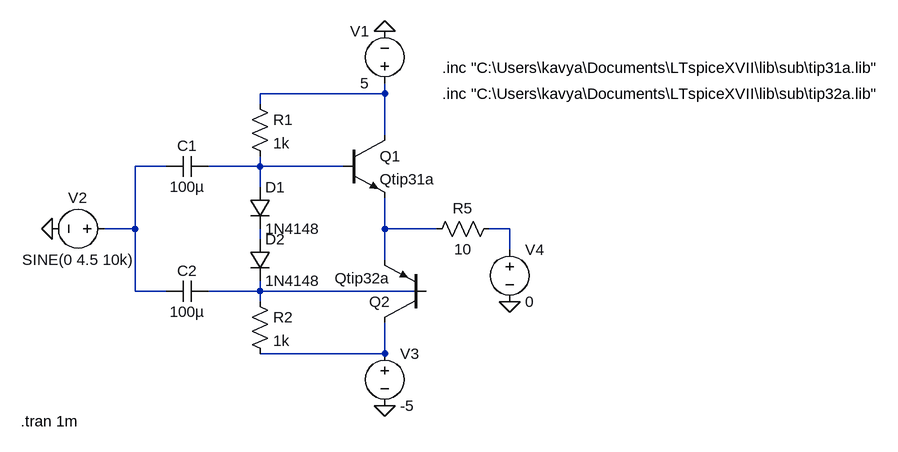
[diagram p0: schematic poweramp.asc]
poweramp.asc, the LTspice schematic file:
Version 4
SHEET 1 1084 680
WIRE 224 -16 224 -32
WIRE 224 -16 32 -16
WIRE 32 0 32 -16
WIRE 224 48 224 -16
WIRE -112 96 -160 96
WIRE 32 96 32 80
WIRE 32 96 -48 96
WIRE 160 96 32 96
WIRE 32 128 32 96
WIRE -160 192 -160 96
WIRE -160 192 -208 192
WIRE 224 192 224 144
WIRE 304 192 224 192
WIRE 416 192 384 192
WIRE 32 208 32 192
WIRE 416 224 416 192
WIRE 224 240 224 192
WIRE -160 288 -160 192
WIRE -112 288 -160 288
WIRE 32 288 32 272
WIRE 32 288 -48 288
WIRE 288 288 32 288
WIRE 32 304 32 288
WIRE 224 384 224 336
WIRE 224 384 32 384
FLAG -288 192 0
FLAG 224 -112 0
FLAG 224 464 0
FLAG 416 304 0
SYMBOL npn 160 48 R0
SYMATTR InstName Q1
SYMATTR Value Qtip31a
SYMBOL res 16 -16 R0
SYMATTR InstName R1
SYMATTR Value 1k
SYMBOL res 16 288 R0
SYMATTR InstName R2
SYMATTR Value 1k
SYMBOL cap -48 80 R90
WINDOW 0 0 32 VBottom 2
WINDOW 3 32 32 VTop 2
SYMATTR InstName C1
SYMATTR Value 100µ
SYMBOL cap -48 272 R90
WINDOW 0 0 32 VBottom 2
WINDOW 3 32 32 VTop 2
SYMATTR InstName C2
SYMATTR Value 100µ
SYMBOL voltage 224 -16 R180
WINDOW 0 24 96 Left 2
WINDOW 3 24 16 Left 2
WINDOW 123 0 0 Left 0
WINDOW 39 0 0 Left 0
SYMATTR InstName V1
SYMATTR Value 5
SYMBOL voltage -192 192 R90
WINDOW 0 -32 56 VBottom 2
WINDOW 3 32 56 VTop 2
WINDOW 123 0 0 Left 0
WINDOW 39 0 0 Left 0
SYMATTR InstName V2
SYMATTR Value SINE(0 4.5 10k)
SYMBOL res 400 176 R90
WINDOW 0 0 56 VBottom 2
WINDOW 3 32 56 VTop 2
SYMATTR InstName R5
SYMATTR Value 10
SYMBOL voltage 224 368 R0
WINDOW 123 0 0 Left 0
WINDOW 39 0 0 Left 0
SYMATTR InstName V3
SYMATTR Value -5
SYMBOL voltage 416 208 R0
WINDOW 123 0 0 Left 0
WINDOW 39 0 0 Left 0
SYMATTR InstName V4
SYMATTR Value 0
SYMBOL diode 16 128 R0
SYMATTR InstName D1
SYMATTR Value 1N4148
SYMBOL diode 16 208 R0
SYMATTR InstName D2
SYMATTR Value 1N4148
SYMBOL pnp 288 336 R180
SYMATTR InstName Q2
SYMATTR Value Qtip32a
TEXT 312 -56 Left 2 !.inc "C:\\Users\\kavya\\Documents\\LTspiceXVII\\lib\\sub\\tip31a.lib"
TEXT 312 -16 Left 2 !.inc "C:\\Users\\kavya\\Documents\\LTspiceXVII\\lib\\sub\\tip32a.lib"
TEXT -336 488 Left 2 !.tran 1m

The netlist it stands for:
* poweramp.asc
Q1 N001 N003 N004 0 Qtip31a
R1 N001 N003 1k
R2 N007 N008 1k
C1 N003 N002 100µ
C2 N007 N002 100µ
V1 N001 0 5
V2 N002 0 SINE(0 4.5 10k)
R5 N005 N004 10
V3 N008 0 -5
V4 N005 0 0
D1 N003 N006 1N4148
D2 N006 N007 1N4148
Q2 N008 N007 N004 0 Qtip32a
.model D D
.lib standard.dio
.model NPN NPN
.model PNP PNP
.lib standard.bjt
.inc "C:\Users\kavya\Documents\LTspiceXVII\lib\sub\tip31a.lib"
.inc "C:\Users\kavya\Documents\LTspiceXVII\lib\sub\tip32a.lib"
.tran 1m
.backanno
.end